# Altium project Jetson AGX Xavier Carrier Board.PrjPcb (part 1 of 8)
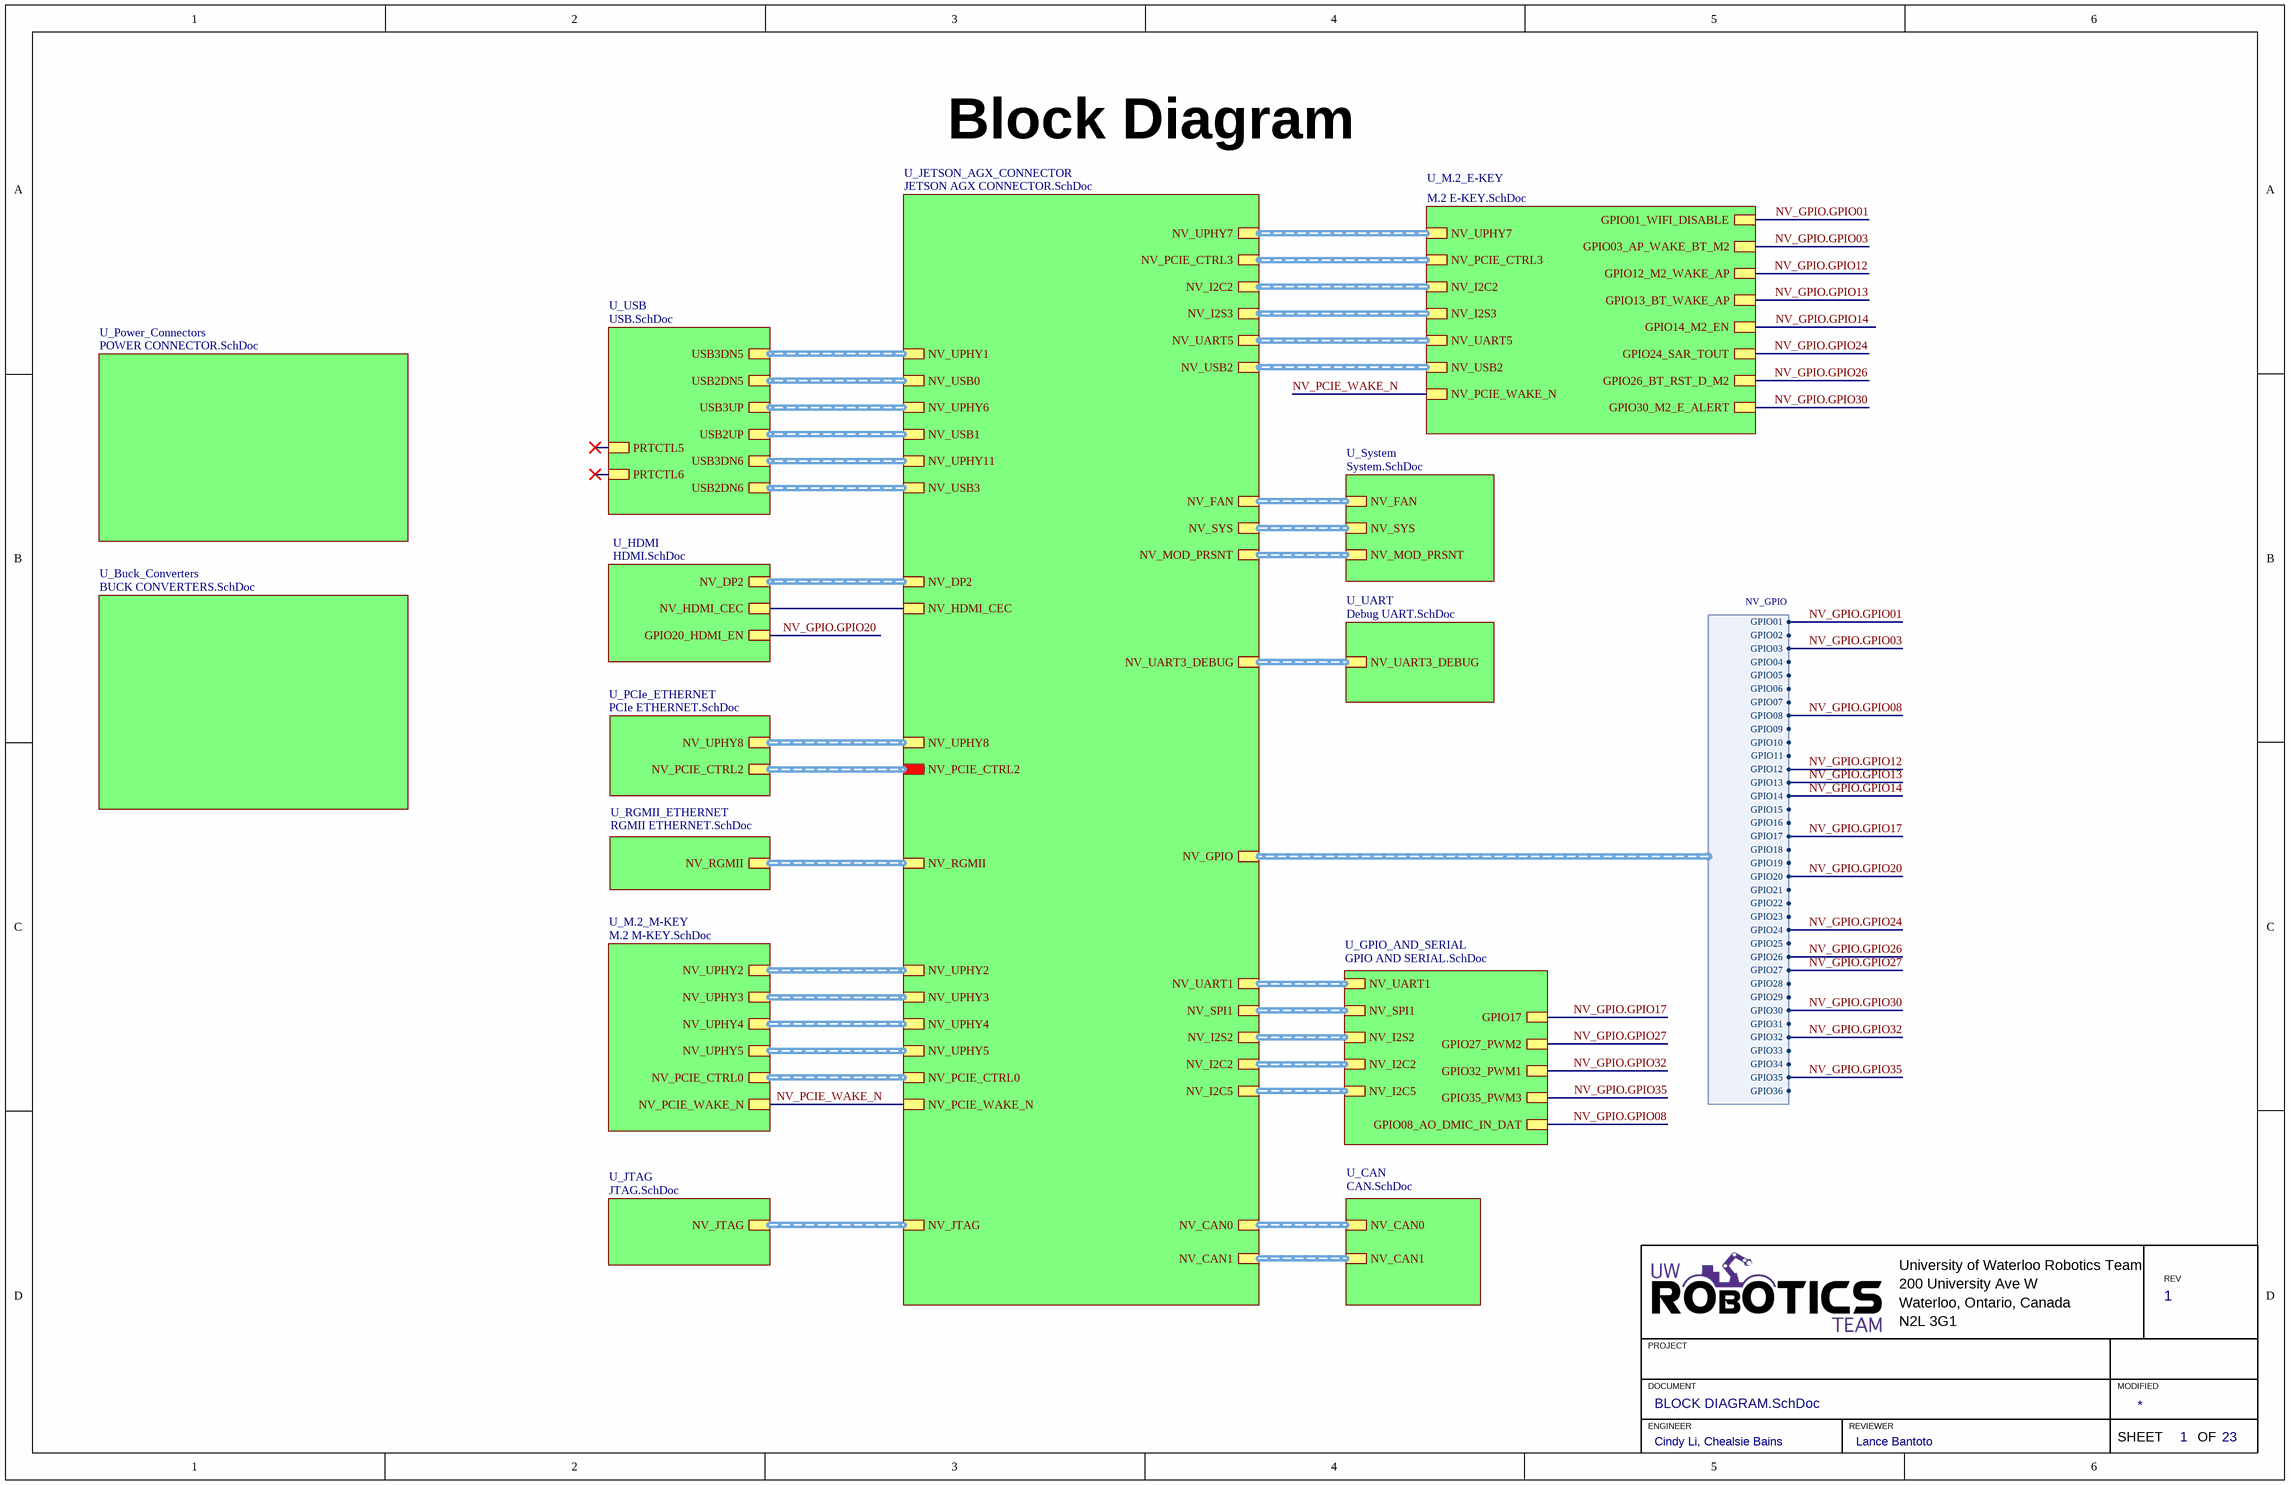
[diagram p0: BLOCK DIAGRAM.SchDoc]
23 sheets, 600 parts. Net scope: global (net labels, ports and power ports of the same name join across sheets).
Board file: Jetson AGX Xavier Carrier Board.PcbDoc
Sheets:
  BLOCK DIAGRAM.SchDoc
    U_HDMI = HDMI.SchDoc
    U_JTAG = JTAG.SchDoc
    U_USB = USB.SchDoc
      U_USB_PORT_STACKED = USB PORT STACKED.SchDoc
      U_USB_PORT_ STACKED = USB PORT STACKED.SchDoc
      U_USB_PORT_STACKED = USB PORT STACKED.SchDoc
    U_PCIe_ETHERNET = PCIe ETHERNET.SchDoc
    U_M.2_E-KEY = M.2 E-KEY.SchDoc
    U_M.2_M-KEY = M.2 M-KEY.SchDoc
    U_GPIO_AND_SERIAL = GPIO AND SERIAL.SchDoc
    U_CAN = CAN.SchDoc
    U_JETSON_AGX_CONNECTOR = JETSON AGX CONNECTOR.SchDoc
      U_JETSON_AGX_CSI-I2C-I2S = JETSON AGX CSI-I2C-I2S.SchDoc
      U_JETSON_AGX_DP-HDMI-USB-GBE = JETSON AGX DP-HDMI-USB-GBE.SchDoc
      U_JETSON_AGX_SDIO-SPI-UART-CAN-GPIO = JETSON AGX SDIO-SPI-UART-CAN-GPIO.SchDoc
      U_JETSON_AGX_SYS-PWR-GND = JETSON AGX SYS-PWR-GND.SchDoc
      U_JETSON_AGX_UPHY = JETSON AGX UPHY.SchDoc
      U_JETSON_AGX_NVHS = JETSON AGX NVHS.SchDoc
      U_JETSON_AGX_PCIE = JETSON AGX PCIE.SchDoc
    U_RGMII_ETHERNET = RGMII ETHERNET.SchDoc
    U_System = System.SchDoc
    U_UART = Debug UART.SchDoc
    U_Power_Connectors = POWER CONNECTOR.SchDoc
    U_Buck_Converters = BUCK CONVERTERS.SchDoc

## Sheet BLOCK DIAGRAM.SchDoc: Block Diagram
size 431 x 279 mm; CheckedBy: Lance Bantoto; Engineer: Cindy Li, Chealsie Bains; DocumentNumber: 1; Revision: 1; SheetNumber: 1; SheetTotal: 23

### Sub-sheets
U_Buck_Converters = BUCK CONVERTERS.SchDoc: no entries
U_CAN = CAN.SchDoc: NV_CAN0 (harness CAN), NV_CAN1 (harness CAN)
U_GPIO_AND_SERIAL = GPIO AND SERIAL.SchDoc: NV_UART1 (harness UART_5-W), NV_SPI1 (harness UART_5-W), NV_I2S2 (harness UART_5-W), GPIO17, GPIO27_PWM2, GPIO32_PWM1, GPIO35_PWM3, GPIO08_AO_DMIC_IN_DAT, NV_I2C2 (harness UART_5-W), NV_I2C5 (harness UART_5-W)
U_HDMI = HDMI.SchDoc: NV_DP2 (harness DISPLAYPORT), NV_HDMI_CEC, GPIO20_HDMI_EN
U_JETSON_AGX_CONNECTOR = JETSON AGX CONNECTOR.SchDoc: NV_UPHY7 (harness UPHY), NV_PCIE_CTRL3 (harness PCIE_CTRL), NV_I2C2 (harness I2C), NV_I2S3 (harness I2S), NV_UART5 (harness UART_5-W), NV_USB2 (harness USB2), NV_GPIO (harness NV_GPIO), NV_DP2 (harness DISPLAYPORT), NV_HDMI_CEC, NV_CAN0 (harness CAN), NV_CAN1 (harness CAN), NV_USB0 (harness USB2), NV_USB1 (harness USB2), NV_USB3 (harness USB2), NV_UPHY1 (harness UPHY), NV_UPHY6 (harness UPHY), NV_UPHY11 (harness UPHY), NV_JTAG (harness NV_JTAG), NV_UART1 (harness UART_5-W), NV_SPI1 (harness UART_5-W), NV_I2S2 (harness UART_5-W), NV_UPHY8 (harness UPHY), NV_PCIE_CTRL2 (harness PCIE_CTRL), NV_RGMII (harness RGMII), NV_UPHY2 (harness UPHY), NV_UPHY3 (harness UPHY), NV_UPHY4 (harness UPHY), NV_UPHY5 (harness UPHY), NV_PCIE_CTRL0 (harness PCIE CTRL), NV_PCIE_WAKE_N, NV_UART3_DEBUG (harness UART_5-W), NV_I2C2 (harness UART_5-W), NV_I2C5 (harness UART_5-W), NV_FAN, NV_SYS, NV_MOD_PRSNT
U_JTAG = JTAG.SchDoc: NV_JTAG (harness NV_JTAG)
U_M.2_E-KEY = M.2 E-KEY.SchDoc: NV_UPHY7 (harness UPHY), NV_PCIE_CTRL3 (harness PCIE_CTRL), NV_I2C2 (harness I2C), NV_I2S3 (harness I2S), NV_UART5 (harness UART_5-W), NV_USB2 (harness USB2), GPIO12_M2_WAKE_AP, GPIO01_WIFI_DISABLE, GPIO03_AP_WAKE_BT_M2, GPIO13_BT_WAKE_AP, GPIO14_M2_EN, GPIO24_SAR_TOUT, GPIO26_BT_RST_D_M2, GPIO30_M2_E_ALERT, NV_PCIE_WAKE_N
U_M.2_M-KEY = M.2 M-KEY.SchDoc: NV_UPHY2 (harness UPHY), NV_UPHY3 (harness UPHY), NV_UPHY4 (harness UPHY), NV_UPHY5 (harness UPHY), NV_PCIE_CTRL0 (harness PCIE CTRL), NV_PCIE_WAKE_N
U_PCIe_ETHERNET = PCIe ETHERNET.SchDoc: NV_UPHY8 (harness UPHY), NV_PCIE_CTRL2 (harness PCIE CTRL)
U_Power_Connectors = POWER CONNECTOR.SchDoc: no entries
U_RGMII_ETHERNET = RGMII ETHERNET.SchDoc: NV_RGMII (harness RGMII)
U_System = System.SchDoc: NV_FAN, NV_SYS, NV_MOD_PRSNT
U_UART = Debug UART.SchDoc: NV_UART3_DEBUG (harness UART_5-W)
U_USB = USB.SchDoc: USB2DN5 (harness USB2), USB2UP (harness USB2), USB2DN6 (harness USB2), USB3DN5 (harness UPHY), USB3UP (harness UPHY), USB3DN6 (harness UPHY), PRTCTL5, PRTCTL6

### Harnesses
NV_GPIO: GPIO01, GPIO02, GPIO03, GPIO04, GPIO05, GPIO06, GPIO07, GPIO08, GPIO09, GPIO10, GPIO11, GPIO12, GPIO13, GPIO14, GPIO15, GPIO16, GPIO17, GPIO18, GPIO19, GPIO20, GPIO21, GPIO22, GPIO23, GPIO24, GPIO25, GPIO26, GPIO27, GPIO28, GPIO29, GPIO30, GPIO31, GPIO32, GPIO33, GPIO34, GPIO35, GPIO36

### Nets
NV_GPIO.GPIO01: sheet U_M.2_E-KEY/GPIO01_WIFI_DISABLE, sheet U_JETSON_AGX_CONNECTOR/NV_GPIO.GPIO01
NV_GPIO.GPIO03: sheet U_M.2_E-KEY/GPIO03_AP_WAKE_BT_M2, sheet U_JETSON_AGX_CONNECTOR/NV_GPIO.GPIO03
NV_GPIO.GPIO08: sheet U_GPIO_AND_SERIAL/GPIO08_AO_DMIC_IN_DAT, sheet U_JETSON_AGX_CONNECTOR/NV_GPIO.GPIO08
NV_GPIO.GPIO12: sheet U_M.2_E-KEY/GPIO12_M2_WAKE_AP, sheet U_JETSON_AGX_CONNECTOR/NV_GPIO.GPIO12
NV_GPIO.GPIO13: sheet U_M.2_E-KEY/GPIO13_BT_WAKE_AP, sheet U_JETSON_AGX_CONNECTOR/NV_GPIO.GPIO13
NV_GPIO.GPIO14: sheet U_M.2_E-KEY/GPIO14_M2_EN, sheet U_JETSON_AGX_CONNECTOR/NV_GPIO.GPIO14
NV_GPIO.GPIO17: sheet U_GPIO_AND_SERIAL/GPIO17, sheet U_JETSON_AGX_CONNECTOR/NV_GPIO.GPIO17
NV_GPIO.GPIO20: sheet U_HDMI/GPIO20_HDMI_EN, sheet U_JETSON_AGX_CONNECTOR/NV_GPIO.GPIO20
NV_GPIO.GPIO24: sheet U_M.2_E-KEY/GPIO24_SAR_TOUT, sheet U_JETSON_AGX_CONNECTOR/NV_GPIO.GPIO24
NV_GPIO.GPIO26: sheet U_M.2_E-KEY/GPIO26_BT_RST_D_M2, sheet U_JETSON_AGX_CONNECTOR/NV_GPIO.GPIO26
NV_GPIO.GPIO27: sheet U_GPIO_AND_SERIAL/GPIO27_PWM2, sheet U_JETSON_AGX_CONNECTOR/NV_GPIO.GPIO27
NV_GPIO.GPIO30: sheet U_M.2_E-KEY/GPIO30_M2_E_ALERT, sheet U_JETSON_AGX_CONNECTOR/NV_GPIO.GPIO30
NV_GPIO.GPIO32: sheet U_GPIO_AND_SERIAL/GPIO32_PWM1, sheet U_JETSON_AGX_CONNECTOR/NV_GPIO.GPIO32
NV_GPIO.GPIO35: sheet U_GPIO_AND_SERIAL/GPIO35_PWM3, sheet U_JETSON_AGX_CONNECTOR/NV_GPIO.GPIO35
NV_PCIE_WAKE_N: sheet U_M.2_E-KEY/NV_PCIE_WAKE_N, sheet U_M.2_M-KEY/NV_PCIE_WAKE_N, sheet U_JETSON_AGX_CONNECTOR/NV_PCIE_WAKE_N
(unnamed): sheet U_HDMI/NV_HDMI_CEC, sheet U_JETSON_AGX_CONNECTOR/NV_HDMI_CEC

### Buses and harness runs
harness sheet U_CAN/NV_CAN0 = sheet U_JETSON_AGX_CONNECTOR/NV_CAN0
harness sheet U_CAN/NV_CAN1 = sheet U_JETSON_AGX_CONNECTOR/NV_CAN1
harness sheet U_GPIO_AND_SERIAL/NV_I2C2 = sheet U_JETSON_AGX_CONNECTOR/NV_I2C2
harness sheet U_GPIO_AND_SERIAL/NV_I2C5 = sheet U_JETSON_AGX_CONNECTOR/NV_I2C5
harness sheet U_GPIO_AND_SERIAL/NV_I2S2 = sheet U_JETSON_AGX_CONNECTOR/NV_I2S2
harness sheet U_GPIO_AND_SERIAL/NV_SPI1 = sheet U_JETSON_AGX_CONNECTOR/NV_SPI1
harness sheet U_GPIO_AND_SERIAL/NV_UART1 = sheet U_JETSON_AGX_CONNECTOR/NV_UART1
harness sheet U_HDMI/NV_DP2 = sheet U_JETSON_AGX_CONNECTOR/NV_DP2
harness sheet U_JETSON_AGX_CONNECTOR/NV_FAN = sheet U_System/NV_FAN
harness sheet U_JETSON_AGX_CONNECTOR/NV_I2C2 = sheet U_M.2_E-KEY/NV_I2C2
harness sheet U_JETSON_AGX_CONNECTOR/NV_I2S3 = sheet U_M.2_E-KEY/NV_I2S3
harness sheet U_JETSON_AGX_CONNECTOR/NV_JTAG = sheet U_JTAG/NV_JTAG
harness sheet U_JETSON_AGX_CONNECTOR/NV_MOD_PRSNT = sheet U_System/NV_MOD_PRSNT
harness sheet U_JETSON_AGX_CONNECTOR/NV_PCIE_CTRL0 = sheet U_M.2_M-KEY/NV_PCIE_CTRL0
harness sheet U_JETSON_AGX_CONNECTOR/NV_PCIE_CTRL2 = sheet U_PCIe_ETHERNET/NV_PCIE_CTRL2
harness sheet U_JETSON_AGX_CONNECTOR/NV_PCIE_CTRL3 = sheet U_M.2_E-KEY/NV_PCIE_CTRL3
harness sheet U_JETSON_AGX_CONNECTOR/NV_RGMII = sheet U_RGMII_ETHERNET/NV_RGMII
harness sheet U_JETSON_AGX_CONNECTOR/NV_SYS = sheet U_System/NV_SYS
harness sheet U_JETSON_AGX_CONNECTOR/NV_UART3_DEBUG = sheet U_UART/NV_UART3_DEBUG
harness sheet U_JETSON_AGX_CONNECTOR/NV_UART5 = sheet U_M.2_E-KEY/NV_UART5
harness sheet U_JETSON_AGX_CONNECTOR/NV_UPHY1 = sheet U_USB/USB3DN5
harness sheet U_JETSON_AGX_CONNECTOR/NV_UPHY2 = sheet U_M.2_M-KEY/NV_UPHY2
harness sheet U_JETSON_AGX_CONNECTOR/NV_UPHY3 = sheet U_M.2_M-KEY/NV_UPHY3
harness sheet U_JETSON_AGX_CONNECTOR/NV_UPHY4 = sheet U_M.2_M-KEY/NV_UPHY4
harness sheet U_JETSON_AGX_CONNECTOR/NV_UPHY5 = sheet U_M.2_M-KEY/NV_UPHY5
harness sheet U_JETSON_AGX_CONNECTOR/NV_UPHY6 = sheet U_USB/USB3UP
harness sheet U_JETSON_AGX_CONNECTOR/NV_UPHY7 = sheet U_M.2_E-KEY/NV_UPHY7
harness sheet U_JETSON_AGX_CONNECTOR/NV_UPHY8 = sheet U_PCIe_ETHERNET/NV_UPHY8
harness sheet U_JETSON_AGX_CONNECTOR/NV_UPHY11 = sheet U_USB/USB3DN6
harness sheet U_JETSON_AGX_CONNECTOR/NV_USB0 = sheet U_USB/USB2DN5
harness sheet U_JETSON_AGX_CONNECTOR/NV_USB1 = sheet U_USB/USB2UP
harness sheet U_JETSON_AGX_CONNECTOR/NV_USB2 = sheet U_M.2_E-KEY/NV_USB2
harness sheet U_JETSON_AGX_CONNECTOR/NV_USB3 = sheet U_USB/USB2DN6

### Notes on the sheet
- University of Waterloo Robotics Team
- 200 University Ave W
- REV
- PROJECT
- Waterloo, Ontario, Canada
- N2L 3G1
- DOCUMENT
- ENGINEER
- REVIEWER
- MODIFIED
- SHEET
- OF

## Sheet HDMI.SchDoc: HDMI
size 431 x 279 mm; CheckedBy: Lance Bantoto; Engineer: Cindy Li; DocumentNumber: 15; Revision: 1; SheetNumber: 15; SheetTotal: 23
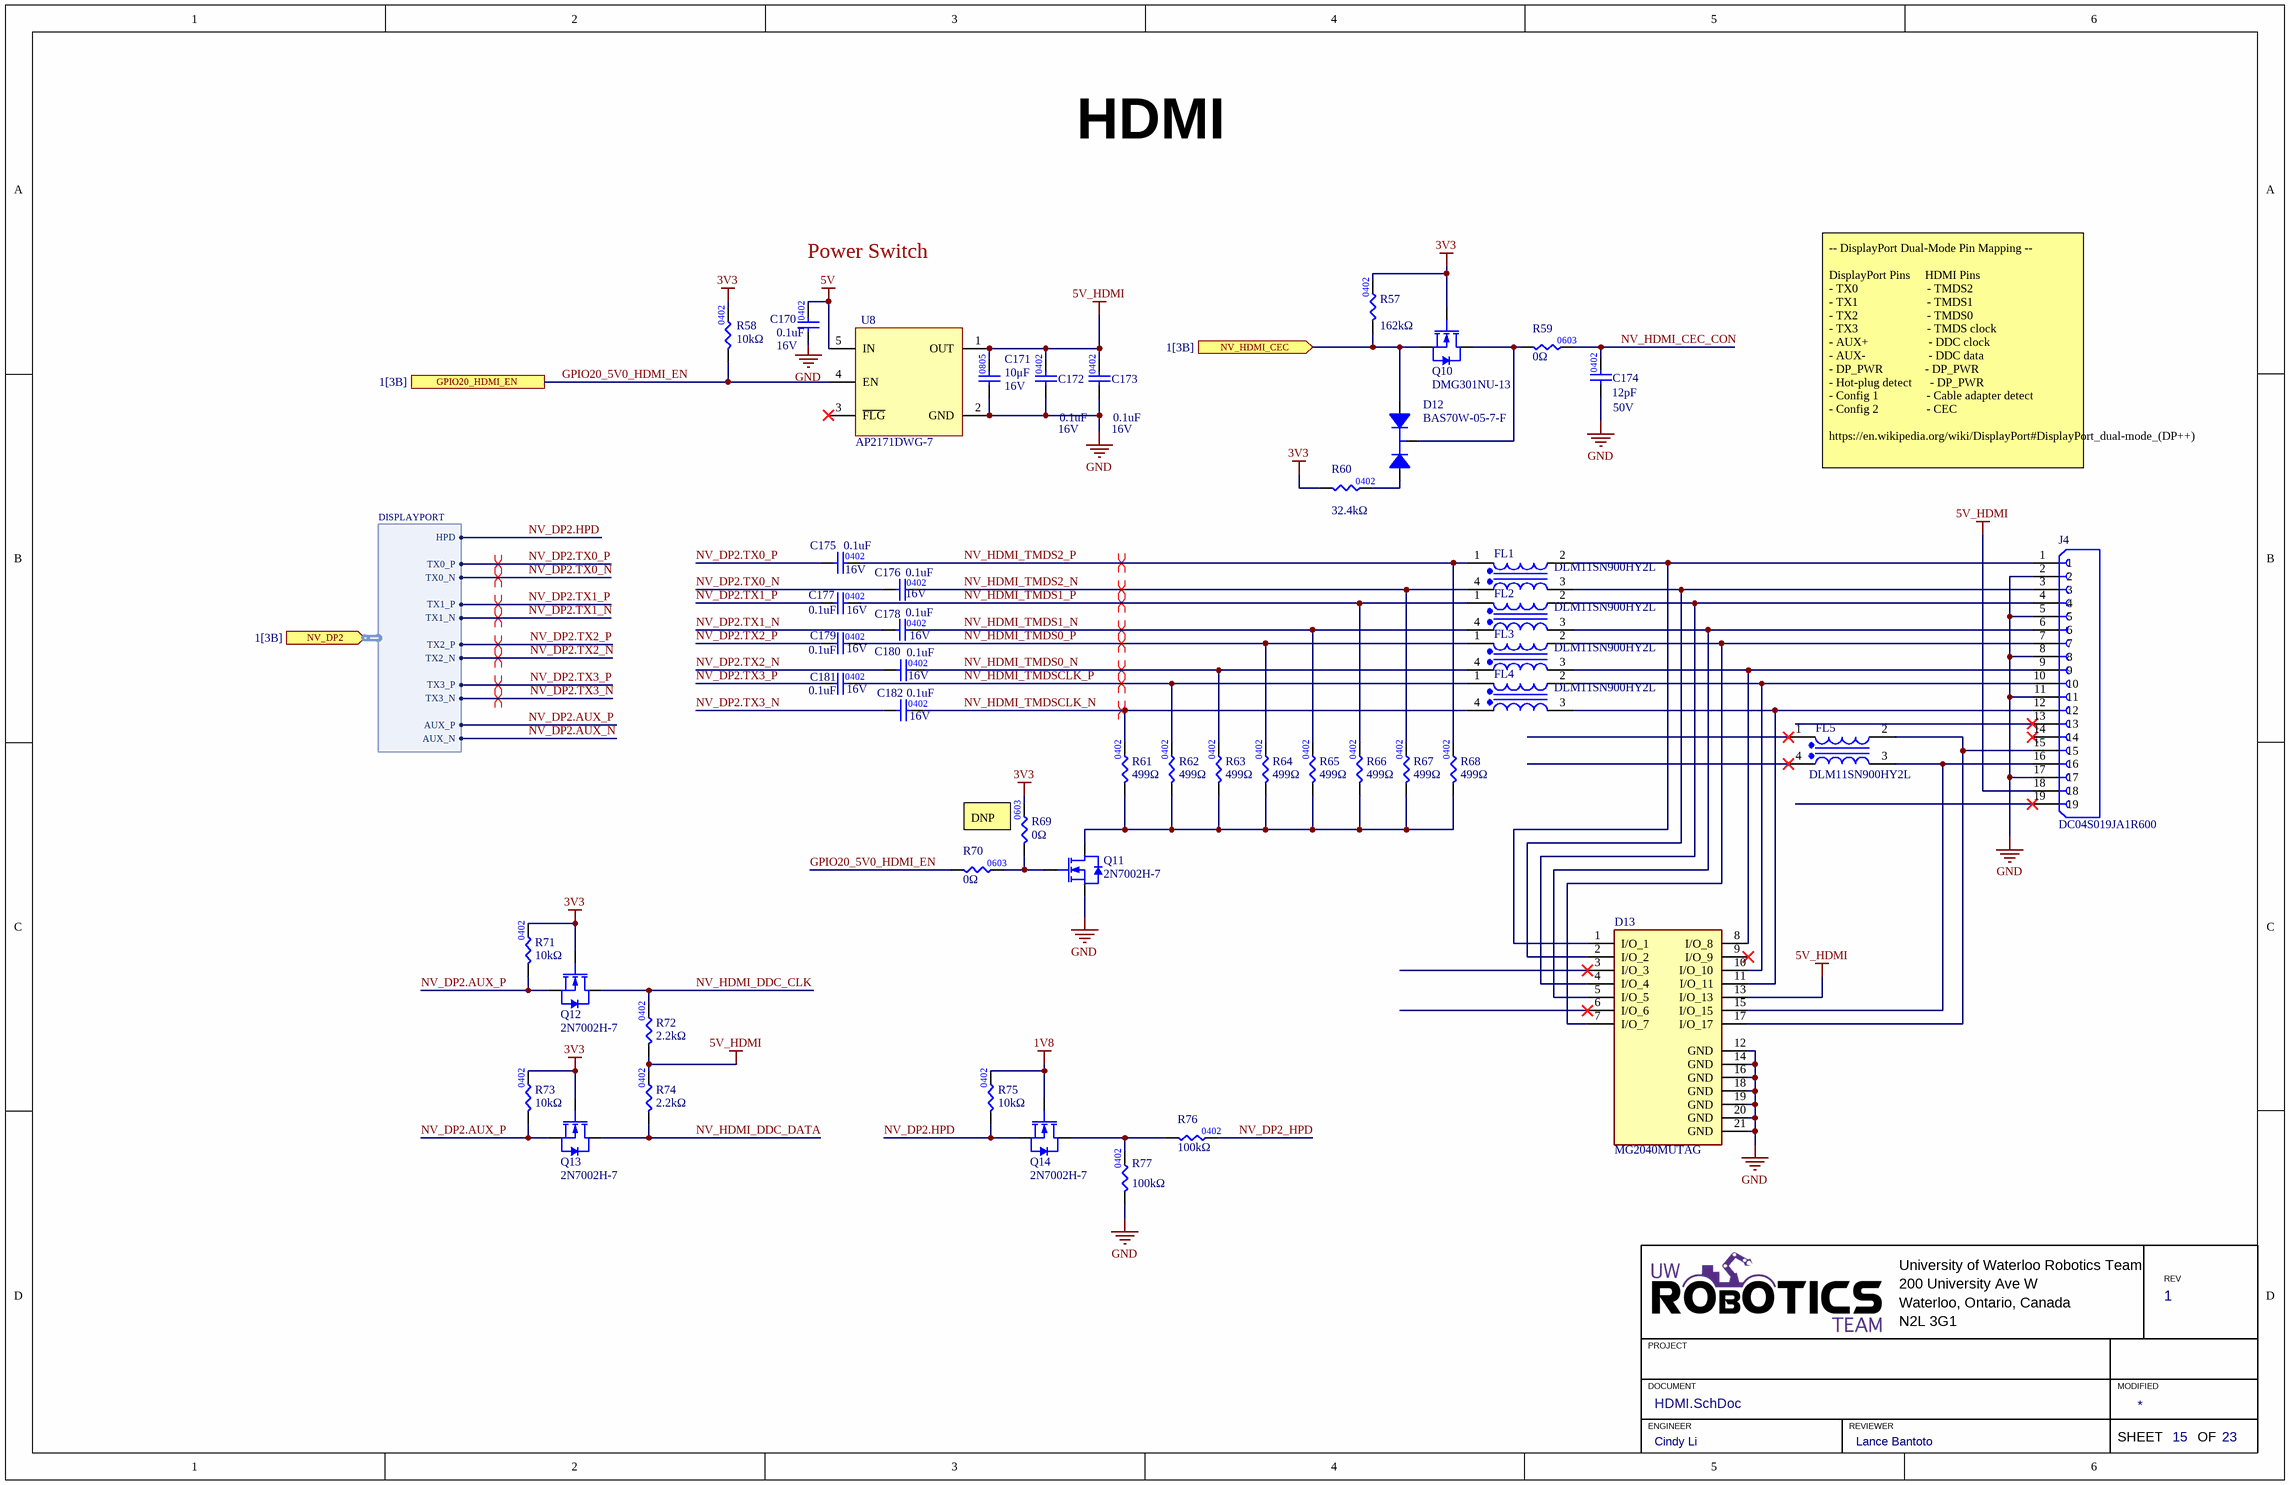
[diagram p1: HDMI.SchDoc]

### Parts
C170  Rated DC Voltage (URdc): 16V  Capacitance: 0.1uF  [CAP0402]  (hidden comment: CAP_0.1uF_16V_X7R_0402)
C171  value 10μF  Voltage Rating: 16V  [CAP2012]  (hidden comment: CAP_10uF_16V_0805)
C172  Rated DC Voltage (URdc): 16V  Capacitance: 0.1uF  [CAP0402]  (hidden comment: CAP_0.1uF_16V_X7R_0402)
C173  Rated DC Voltage (URdc): 16V  Capacitance: 0.1uF  [CAP0402]  (hidden comment: CAP_0.1uF_16V_X7R_0402)
C174  value 12pF  Voltage Rating: 50V  [CAP0402]  (hidden comment: CAP_12pF_50V_0402)
C175  Capacitance: 0.1uF  Rated DC Voltage (URdc): 16V  [CAP0402]  (hidden comment: CAP_0.1uF_16V_X7R_0402)
C176  Capacitance: 0.1uF  Rated DC Voltage (URdc): 16V  [CAP0402]  (hidden comment: CAP_0.1uF_16V_X7R_0402)
C177  Capacitance: 0.1uF  Rated DC Voltage (URdc): 16V  [CAP0402]  (hidden comment: CAP_0.1uF_16V_X7R_0402)
C178  Capacitance: 0.1uF  Rated DC Voltage (URdc): 16V  [CAP0402]  (hidden comment: CAP_0.1uF_16V_X7R_0402)
C179  Capacitance: 0.1uF  Rated DC Voltage (URdc): 16V  [CAP0402]  (hidden comment: CAP_0.1uF_16V_X7R_0402)
C180  Capacitance: 0.1uF  Rated DC Voltage (URdc): 16V  [CAP0402]  (hidden comment: CAP_0.1uF_16V_X7R_0402)
C181  Capacitance: 0.1uF  Rated DC Voltage (URdc): 16V  [CAP0402]  (hidden comment: CAP_0.1uF_16V_X7R_0402)
C182  Capacitance: 0.1uF  Rated DC Voltage (URdc): 16V  [CAP0402]  (hidden comment: CAP_0.1uF_16V_X7R_0402)
D12  BAS70W-05-7-F  [SOT323_BAS70W-05-7-F]
D13  MG2040MUTAG  [DIO_MG2040MUTAG]
FL1  DLM11SN900HY2L  [FIL_DLM11SN900HY2L]
FL2  DLM11SN900HY2L  [FIL_DLM11SN900HY2L]
FL3  DLM11SN900HY2L  [FIL_DLM11SN900HY2L]
FL4  DLM11SN900HY2L  [FIL_DLM11SN900HY2L]
FL5  DLM11SN900HY2L  [FIL_DLM11SN900HY2L]
J4  DC04S019JA1R600  [JAE_DC04S019JA1R600]
Q10  DMG301NU-13  [SOT23-3]
Q11  2N7002H-7  [SOT23-3]
Q12  2N7002H-7  [SOT23-3]
Q13  2N7002H-7  [SOT23-3]
Q14  2N7002H-7  [SOT23-3]
R57  value 162kΩ  [RES0402]  (hidden comment: RES_162kΩ_0402_1%)
R58  value 10kΩ  [RES0402]  (hidden comment: RES_10kΩ_0402_1%)
R59  value 0Ω  [RES0603]  (hidden comment: RES_0Ω_0603)
R60  value 32.4kΩ  [RES0402]  (hidden comment: RES_32.4kΩ_0402_1%)
R61  value 499Ω  [RES0402]  (hidden comment: RES_499Ω_0402_1%)
R62  value 499Ω  [RES0402]  (hidden comment: RES_499Ω_0402_1%)
R63  value 499Ω  [RES0402]  (hidden comment: RES_499Ω_0402_1%)
R64  value 499Ω  [RES0402]  (hidden comment: RES_499Ω_0402_1%)
R65  value 499Ω  [RES0402]  (hidden comment: RES_499Ω_0402_1%)
R66  value 499Ω  [RES0402]  (hidden comment: RES_499Ω_0402_1%)
R67  value 499Ω  [RES0402]  (hidden comment: RES_499Ω_0402_1%)
R68  value 499Ω  [RES0402]  (hidden comment: RES_499Ω_0402_1%)
R69  value 0Ω  [RES0603]  (hidden comment: RES_0Ω_0603)
R70  value 0Ω  [RES0603]  (hidden comment: RES_0Ω_0603)
R71  value 10kΩ  [RES0402]  (hidden comment: RES_10kΩ_0402_1%)
R72  value 2.2kΩ  [RES0402]  (hidden comment: RES_2.2kΩ_0402_5%)
R73  value 10kΩ  [RES0402]  (hidden comment: RES_10kΩ_0402_1%)
R74  value 2.2kΩ  [RES0402]  (hidden comment: RES_2.2kΩ_0402_5%)
R75  value 10kΩ  [RES0402]  (hidden comment: RES_10kΩ_0402_1%)
R76  value 100kΩ  [RES0402]  (hidden comment: RES_100kΩ_0402_5%)
R77  value 100kΩ  [RES0402]  (hidden comment: RES_100kΩ_0402_5%)
U8  AP2171DWG-7  [AP2171DWG-7]

### Ports
GPIO20_HDMI_EN (see 1[3B]), NV_DP2 (in, harness DISPLAYPORT, see 1[3B]), NV_HDMI_CEC (in, see 1[3B])

### Harnesses
DISPLAYPORT: HPD, TX0_P, TX0_N, TX1_P, TX1_N, TX2_P, TX2_N, TX3_P, TX3_N, AUX_P, AUX_N

### Nets
1V8: Q14.1(GATE) R75.2
3V3: Q10.1(GATE) Q12.1(GATE) Q13.1(GATE) R57.2 R58.2 R60.1 R69.2 R71.2 R73.2
5V: C170.2 U8.5(IN)
5V_HDMI: C171.2 C172.2 C173.2 D13.13(I/O_13) J4.18 R72.1 R74.2 U8.1(OUT)
GND: C170.1 C171.1 C172.1 C173.1 C174.1 D13.12(GND) D13.14(GND) D13.16(GND) D13.18(GND) D13.19(GND) D13.20(GND) D13.21(GND) J4.2 J4.5 J4.8 J4.11 J4.17 Q11.2(SOURCE) R77.1 U8.2(GND)
GPIO20_5V0_HDMI_EN: R58.1 R70.1 U8.4(EN) ; port GPIO20_HDMI_EN
NV_DP2.AUX_P: Q12.2(SOURCE) Q13.2(SOURCE) R71.1 R73.1 ; port NV_DP2.AUX_P
NV_DP2.HPD: Q14.2(SOURCE) R75.1 ; port NV_DP2.HPD
NV_DP2.TX0_N: C176.1 ; port NV_DP2.TX0_N
NV_DP2.TX0_P: C175.1 ; port NV_DP2.TX0_P
NV_DP2.TX1_N: C178.1 ; port NV_DP2.TX1_N
NV_DP2.TX1_P: C177.1 ; port NV_DP2.TX1_P
NV_DP2.TX2_N: C180.1 ; port NV_DP2.TX2_N
NV_DP2.TX2_P: C179.1 ; port NV_DP2.TX2_P
NV_DP2.TX3_N: C182.1 ; port NV_DP2.TX3_N
NV_DP2.TX3_P: C181.1 ; port NV_DP2.TX3_P
NV_DP2_HPD: R76.2
NV_HDMI_CEC: D12.2 Q10.2(SOURCE) R57.1 ; port NV_HDMI_CEC
NV_HDMI_CEC_CON: C174.2 R59.2
NV_HDMI_DDC_CLK: Q12.3(DRAIN) R72.2
NV_HDMI_DDC_DATA: Q13.3(DRAIN) R74.1
NV_HDMI_TMDS0_N: C180.2 FL3.4 R63.2
NV_HDMI_TMDS0_P: C179.2 FL3.1 R64.2
NV_HDMI_TMDS1_N: C178.2 FL2.4 R65.2
NV_HDMI_TMDS1_P: C177.2 FL2.1 R66.2
NV_HDMI_TMDS2_N: C176.2 FL1.4 R67.2
NV_HDMI_TMDS2_P: C175.2 FL1.1 R68.2
NV_HDMI_TMDSCLK_N: C182.2 FL4.4 R61.2
NV_HDMI_TMDSCLK_P: C181.2 FL4.1 R62.2
NetD12_1: D12.1 R60.2
NetD12_3: D12.3 Q10.3(DRAIN) R59.1
NetD13_1: D13.1(I/O_1) FL1.2 J4.1
NetD13_2: D13.2(I/O_2) FL1.3 J4.3
NetD13_4: D13.4(I/O_4) FL2.2 J4.4
NetD13_5: D13.5(I/O_5) FL2.3 J4.6
NetD13_7: D13.7(I/O_7) FL3.2 J4.7
NetD13_8: D13.8(I/O_8) FL3.3 J4.9
NetD13_10: D13.10(I/O_10) FL4.2 J4.10
NetD13_11: D13.11(I/O_11) FL4.3 J4.12
NetD13_15: D13.15(I/O_15) FL5.3 J4.16
NetD13_17: D13.17(I/O_17) FL5.2 J4.15
NetQ11_1: Q11.1(GATE) R69.1 R70.2
NetQ11_3: Q11.3(DRAIN) R61.1 R62.1 R63.1 R64.1 R65.1 R66.1 R67.1 R68.1
NetQ14_3: Q14.3(DRAIN) R76.1 R77.2

Not connected (* = marked no-connect by the designer): D13 3(I/O_3)* 6(I/O_6)* 9(I/O_9)*; FL5 1* 4*; J4 13* 14* 19*; U8 3(~{FLG})*

### Layout directives
differential pair: NV_DP2.TX0_N, NV_DP2.TX0_P, NV_DP2.TX1_N, NV_DP2.TX1_P, NV_DP2.TX2_N, NV_DP2.TX2_P, NV_DP2.TX3_N, NV_DP2.TX3_P, NV_HDMI_TMDS0_N, NV_HDMI_TMDS0_P, NV_HDMI_TMDS1_N, NV_HDMI_TMDS1_P, NV_HDMI_TMDS2_N, NV_HDMI_TMDS2_P, NV_HDMI_TMDSCLK_N, NV_HDMI_TMDSCLK_P

### Notes on the sheet
- Power Switch
- -- DisplayPort Dual-Mode Pin Mapping --
  DisplayPort Pins     HDMI Pins
  - TX0                       - TMDS2
  - TX1                       - TMDS1
  - TX2                       - TMDS0
  - TX3                       - TMDS clock
  - AUX+                    - DDC clock
  - AUX-                     - DDC data
  - DP_PWR              - DP_PWR
  - Hot-plug detect      - DP_PWR
  - Config 1                - Cable adapter detect
  - Config 2                - CEC
  https://en.wikipedia.org/wiki/DisplayPort#DisplayPort_dual-mode_(DP++)
- (near R69) DNP
- University of Waterloo Robotics Team
- 200 University Ave W
- REV
- PROJECT
- Waterloo, Ontario, Canada
- N2L 3G1
- DOCUMENT
- ENGINEER
- REVIEWER
- MODIFIED
- SHEET
- OF

### Library data of the parts
C170 C172 C173 C175-C182 = CAP_0.1uF_16V_X7R_0402: Ceramic Capacitor, Ceramic; Manufacturer: Taiyo Yuden; Manufacturer Part Number: LMK212AC6106MD-T; Multilayer: Yes; Negative Tolerance: 10%; Temperature Characteristics Code: X7R; Supplier Part Number 1: 587-6337-1-ND; Supplier 1: Digi-Key; RoHS: Yes; Stock 1: 703; Pricing 1: 1=0.29000, 10=0.20100, 50=0.12060, 100=0.10180, 500=0.06966, 1000=0.06163 (USD); ComponentLink1URL: https://datasheet.ciiva.com:443/pdfs/VipMasterIC/IC/TAIY/TAIY-S-A0009099504/TAIY-S-A0009099407-1.pdf?src-supplier=IHS+Markit; ComponentLink1Description: https://datasheet.ciiva.com:443/pdfs/VipMasterIC/IC/TAIY/TAIY-S-A0009099504/TAIY-S-A0009099407-1.pdf?src-supplier=IHS+Markit; ComponentLink2URL: https://ds.yuden.co.jp/TYCOMPAS/ut/detail?pn=LMK212AC6106MD-T &amp;u=M&src-supplier=Digi-Key; ComponentLink2Description: https://ds.yuden.co.jp/TYCOMPAS/ut/detail?pn=LMK212AC6106MD-T &amp;u=M&src-supplier=Digi-Key; Supplier 2: Digi-Key; Supplier Part Number 2: 1292-1630-1-ND; Category: Ceramic Capacitors; Stock 2: 20327886; Pricing 2: 1=0.10000, 10=0.02800, 50=0.01500, 100=0.01220, 500=0.00876, 1000=0.00688, 2500=0.00625, 5000=0.00575 (USD); Mount: Surface Mount; Number of Pins: 2; Dielectric Material: Ceramic; Package Shape: Rectangular; Terminal Finish: Nickel; Min Operating Temperature: -55°C; Max Operating Temperature: 125°C; JESD-609 Code: e3; Capacitor Type: Ceramic; Package Style: SMTMeter; Packaging: Tape and Reel; Positive Tolerance: 10%; Termination: Wraparound; Length: 1mm; Width: 0.5mm; Height: 0.5mm; REACH SVHC: Yes; RoHS Compliant: Yes; ComponentLink3URL: https://datasheet.ciiva.com:443/pdfs/VipMasterIC/IC/WATC/WATC-S-A0009550342/WATC-S-A0009550342-1.pdf?src-supplier=IHS+Markit; ComponentLink3Description: https://datasheet.ciiva.com:443/pdfs/VipMasterIC/IC/WATC/WATC-S-A0009550342/WATC-S-A0009550342-1.pdf?src-supplier=IHS+Markit; ComponentLink4URL: http://www.farnell.com/datasheets/2340522.pdf?src-supplier=Farnell; ComponentLink4Description: http://www.farnell.com/datasheets/2340522.pdf?src-supplier=Farnell; ComponentLink5URL: http://components.arrow.com/part/dataview/0323_00654690?src-supplier=Arrow+Europe; ComponentLink5Description: http://components.arrow.com/part/dataview/0323_00654690?src-supplier=Arrow+Europe; ComponentLink6URL: https://www.verical.com/server-webapp/html/getDatasheet?partID=415228&src-supplier=Verical; ComponentLink6Description: https://www.verical.com/server-webapp/html/getDatasheet?partID=415228&src-supplier=Verical; ComponentLink7URL: http://www.passivecomponent.com/indexsea/0402B104K160CT-IN.pdf?src-supplier=Digi-Key; ComponentLink7Description: http://www.passivecomponent.com/indexsea/0402B104K160CT-IN.pdf?src-supplier=Digi-Key; ComponentLink8URL: http://www.passivecomponent.com/wp-content/uploads/2018/10/MLCC.pdf?src-supplier=Digi-Key; ComponentLink8Description: http://www.passivecomponent.com/wp-content/uploads/2018/10/MLCC.pdf?src-supplier=Digi-Key; ComponentLink9URL: http://www.farnell.com/datasheets/2340522.pdf?src-supplier=Element14; ComponentLink9Description: http://www.farnell.com/datasheets/2340522.pdf?src-supplier=Element14; ComponentLink10URL: http://www.farnell.com/datasheets/2340522.pdf?src-supplier=Newark; ComponentLink10Description: http://www.farnell.com/datasheets/2340522.pdf?src-supplier=Newark; Size Code: 0402; Supplier 3: Digi-Key; Supplier Part Number 3: 445-173645-1-ND; Stock 3: 3627; Pricing 3: 1=0.20000, 10=0.14200, 50=0.08080, 100=0.06700, 500=0.04696, 1000=0.03888, 2500=0.03619, 5000=0.03311 (USD); ComponentLink11URL: https://datasheet.ciiva.com:443/pdfs/VipMasterIC/IC/TDKC/TDKC-S-A0007785269/TDKC-S-A0007785269-1.pdf?src-supplier=IHS+Markit; ComponentLink11Description: https://datasheet.ciiva.com:443/pdfs/VipMasterIC/IC/TDKC/TDKC-S-A0007785269/TDKC-S-A0007785269-1.pdf?src-supplier=IHS+Markit; ComponentLink12URL: https://product.tdk.com/info/en/catalog/spec/mlccspec_commercial_soft_en.pdf?src-supplier=Digi-Key; ComponentLink12Description: https://product.tdk.com/info/en/catalog/spec/mlccspec_commercial_soft_en.pdf?src-supplier=Digi-Key
C171 = CAP_10uF_16V_0805: CAP CER 10UF 16V X5R 0805; Manufacturer 1: Yageo; Manufacturer Part Number 1: CC0805KKX5R7BB106; Package/Footprint: 0805; Supplier Part Number 1: 311-1865-1-ND; Supplier 1: Digi-Key; Mounting Type: SMD; Dielectric: X5R
C174 = CAP_12pF_50V_0402: CAP CER 12PF 50V C0G 0402; Manufacturer Part Number 1: CC0603KRX7R9BB104; Manufacturer 1: TDK Corporation; Package/Footprint: 0402; Dielectric: C0G, NP0; Tolerance: ±5%; Supplier Part Number 1: 445-5585-1-ND; Supplier 1: Digi-Key; Mounting Type: SMD
D12 = BAS70W-05-7-F: DIODE ARRAY SCHOTTKY 70V SOT323; Manufacturer 1: Diodes Incorporated; Diode Configuration: 1 Pair Common Cathode; Current - Average Rectified (Io) (per diode): 70mA; Voltage - Forward (Vf) (Max) @ If: 1V @ 15mA; Current - Reverse Leakage @ Vr: 100nA @ 50V; Manufacturer Part Number 1: BAS70W-05-7-F; Supplier 1: Digi-Key; Supplier Part Number 1: BAS70W-05FDICT-ND; Diode Type: Schottky; Package: SOT-323; Voltage - DC Reverse (Vr) (Max): 70V
D13 = MG2040MUTAG: 10V Clamp 1A (8/20µs) Ipp Tvs Diode Surface Mount 18-UDFN (5.5x1.5); Manufacturer 1: ON Semiconductor; Manufacturer Part Number 1: MG2040MUTAG; Supplier 1: Digi-Key; Supplier Part Number 1: MG2040MUTAGCT-ND; Package: 18-UFDFN
FL1-FL5 = DLM11SN900HY2L: 2 Line Common Mode Choke Surface Mount 90 Ohms @ 100 MHz 100mA DCR 1.38Ohm; Manufacturer 1: Murata Electronics; Voltage Rating - DC: 5V; Manfuacturer Part Number 1: DLM11SN900HY2L; Supplier 1: Digi-Key; Supplier Part Number 1: 490-11941-1-ND; Current Rating (Max): 100mA; DC Resistance (DCR) (Max): 1.38Ohm; Package: 0504
J4 = DC04S019JA1R600: HDMI HDMI 2.1 Receptacle Connector 19 Position Surface Mount, Right Angle; Through Hole; Manufacturer 1: JAE Electronics; Current Rating: 0.5A; Manufacturer Part Number 1: DC04S019JA1R600; Supplier 1: Digi-Key; Supplier Part Number 1: 670-3154-1-ND; Specifications: HDMI 2.1; Mounting Type: Surface Mount, Right Angle; Through Hole
Q10 = DMG301NU-13: MOSFET N-CH 25V 260MA SOT23; Manufacturer 1: Diodes Incorporated; Package/Footprint: SOT-23; Id: 260mA (Ta); Vgs (Max): ±8V; Supplier 1: Digi-Key; Mounting Type: SMD; Supplier Part Number 1: DMG301NU-13DICT-ND; Vdss: 25V; Verified: No; Manufacturer Part Number 1: DMG301NU-13
Q11-Q14 = 2N7002H-7: MOSFET N-CH 60V 170MA SOT23; Manufacturer 1: Diodes Incorporated; Package/Footprint: SOT-23; Vgs (Max): ±20V; Supplier 1: Digi-Key; Mounting Type: SMD; Supplier Part Number 1: 2N7002H-7DICT-ND; Id: 170mA; Vdss: 60V; Verified: No; Manufacturer Part Number 1: 2N7002H-7
R57 = RES_162kΩ_0402_1%: RES 162K OHM 1% 1/16W 0402; Manufacturer Part Number 1: RMCF0402FT162K; Manufacturer 1: Panasonic Electronic Components; Power: 0.063W, 1/16W; Package/Footprint: 0402; Supplier 1: Digi-Key; Supplier Part Number 1: RMCF0402FT162KCT-ND; Mounting Type: SMD; Tolerance: 1%
R58 R71 R73 R75 = RES_10kΩ_0402_1%: RES SMD 10K OHM 1% 1/16W 0402; Manufacturer Part Number 1: CRCW040210K0FKTD; Manufacturer 1: Vishay Dale; Power: 0.063W, 1/16W; Package/Footprint: 0402; Supplier 1: Digi-Key; Supplier Part Number 1: 541-2955-1-ND; Mounting Type: SMD; Tolerance: 1%
R59 R69 R70 = RES_0Ω_0603: RES 0 OHM JUMPER 1/10W 0603; Manufacturer 1: Yageo; Manufacturer Part Number 1: RC0603JR-070RL; Package/Footprint: 0603; Supplier Part Number 1: 311-0.0GRCT-ND; Supplier 1: Digi-Key; Mounting Type: SMD
R60 = RES_32.4kΩ_0402_1%: RES SMD 32.4K OHM 1% 1/10W 0402; Manufacturer Part Number 1: ERJ-2RKF3242X; Manufacturer 1: Panasonic Electronic Components; Power: 0.1W, 1/10W; Package/Footprint: 0402; Supplier 1: Digi-Key; Supplier Part Number 1: P32.4KLCT-ND; Mounting Type: SMD; Tolerance: 1%
R61-R68 = RES_499Ω_0402_1%: RES 499 OHM 1% 1/16W 0402; Manufacturer Part Number 1: RMCF0402FT499R; Manufacturer 1: Stackpole Electronics Inc; Package/Footprint: 0402; Power: 0.063W, 1/16W; Supplier 1: Digi-Key; Supplier Part Number 1: RMCF0402FT499RCT-ND; Mounting Type: SMD; Tolerance: 1%
R72 R74 = RES_2.2kΩ_0402_5%: RES SMD 2.2K OHM 5% 1/10W 0402; Manufacturer 1: Panasonic Electronic Components; Manufacturer Part Number 1: ERJ-2GEJ222X; Package/Footprint: 0402; Supplier Part Number 1: P2.2KJCT-ND; Supplier 1: Digi-Key; Mounting Type: SMD
R76 R77 = RES_100kΩ_0402_5%: RES SMD 100K OHM 5% 1/10W 0402; Manufacturer Part Number 1: ERJ-2GEJ104X; Manufacturer 1: Panasonic Electronic Components; Power: 0.1W, 1/10W; Package/Footprint: 0402; Supplier 1: Digi-Key; Supplier Part Number 1: P100KJCT-ND; Mounting Type: SMD; Tolerance: 5%
U8 = AP2171DWG-7: Power Switch/Driver 1:1 P-Channel 1A SOT-25; Manufacturer 1: Diodes Incorporated; Rds On (Typ): 95mOhm; Voltage - Load: 2.7V - 5.5V; Supplier 1: Digi-Key; Supplier Part Number 1: AP2171DWG-7DICT-ND; Manufacturer Part Number 1: AP2171DWG-7; Current - Output (Max): 1A; Package: SOT-25

## Sheet JTAG.SchDoc: JTAG
size 279 x 215 mm; CheckedBy: Lance Bantoto; Engineer: Cindy Li; DocumentNumber: 23; Revision: 1; SheetNumber: 23; SheetTotal: 23
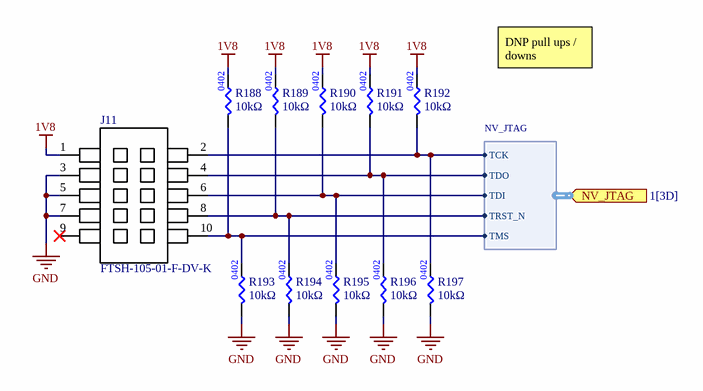
[diagram p2: JTAG.SchDoc]

### Parts
J11  Manufacturer Part Number 1: FTSH-105-01-F-DV-K  [FTSH-105-01-F-DV-K-P-TR]  (hidden comment: CON_PROGRAMMING)
R188  Resistance: 10kΩ  [RES0402]  (hidden comment: RES_10kΩ_0402_1%)
R189  Resistance: 10kΩ  [RES0402]  (hidden comment: RES_10kΩ_0402_1%)
R190  Resistance: 10kΩ  [RES0402]  (hidden comment: RES_10kΩ_0402_1%)
R191  Resistance: 10kΩ  [RES0402]  (hidden comment: RES_10kΩ_0402_1%)
R192  Resistance: 10kΩ  [RES0402]  (hidden comment: RES_10kΩ_0402_1%)
R193  Resistance: 10kΩ  [RES0402]  (hidden comment: RES_10kΩ_0402_1%)
R194  Resistance: 10kΩ  [RES0402]  (hidden comment: RES_10kΩ_0402_1%)
R195  Resistance: 10kΩ  [RES0402]  (hidden comment: RES_10kΩ_0402_1%)
R196  Resistance: 10kΩ  [RES0402]  (hidden comment: RES_10kΩ_0402_1%)
R197  Resistance: 10kΩ  [RES0402]  (hidden comment: RES_10kΩ_0402_1%)

### Ports
NV_JTAG (in, harness NV_JTAG, see 1[3D])

### Harnesses
NV_JTAG: TCK, TDI, TDO, TMS, TRST_N

### Nets
1V8: J11.1 R188.2 R189.2 R190.2 R191.2 R192.2
GND: J11.3 J11.5 J11.7 R193.1 R194.1 R195.1 R196.1 R197.1
NV_JTAG.TCK: J11.2 R192.1 R197.2 ; port NV_JTAG.TCK
NV_JTAG.TDI: J11.6 R190.1 R195.2 ; port NV_JTAG.TDI
NV_JTAG.TDO: J11.4 R191.1 R196.2 ; port NV_JTAG.TDO
NV_JTAG.TMS: J11.10 R188.1 R193.2 ; port NV_JTAG.TMS
NV_JTAG.TRST_N: J11.8 R189.1 R194.2 ; port NV_JTAG.TRST_N

Not connected (* = marked no-connect by the designer): J11 9*

### Notes on the sheet
- DNP pull ups / downs
- University of Waterloo Robotics Team
- 200 University Ave W
- REV
- PROJECT
- Waterloo, Ontario, Canada
- N2L 3G1
- DOCUMENT
- ENGINEER
- REVIEWER
- MODIFIED
- SHEET
- OF

### Library data of the parts
J11 = CON_PROGRAMMING: CONN HEADER SMD 10POS 1.27MM; Manufacturer 1: Samtec; Supplier 1: Digi-Key; Pitch: 1.27mm; Supplier Part Number 1: SAM8796-ND; Mounting Type: SMD
R188-R197 = RES_10kΩ_0402_1%: RES 10K OHM 1% 1/16W 0402; Manufacturer 1: Samsung Electro-Mechanics; Manufacturer Part Number 1: RC1005F103CS; Supplier Part Number 1: 1276-3431-1-ND; Supplier 1: Digi-Key; Tolerance: 1%; Package: 0402

## Sheet USB.SchDoc: USB
size 431 x 279 mm; CheckedBy: Lance Bantoto; Engineer: Cindy Li; Organization: UW Robotics; Address1: 200 University Avenue; Address2: Waterloo; Address3: Ontario; Address4: Canada N2L 3G6; DocumentNumber: 13; Revision: 1; SheetNumber: 13; SheetTotal: 23
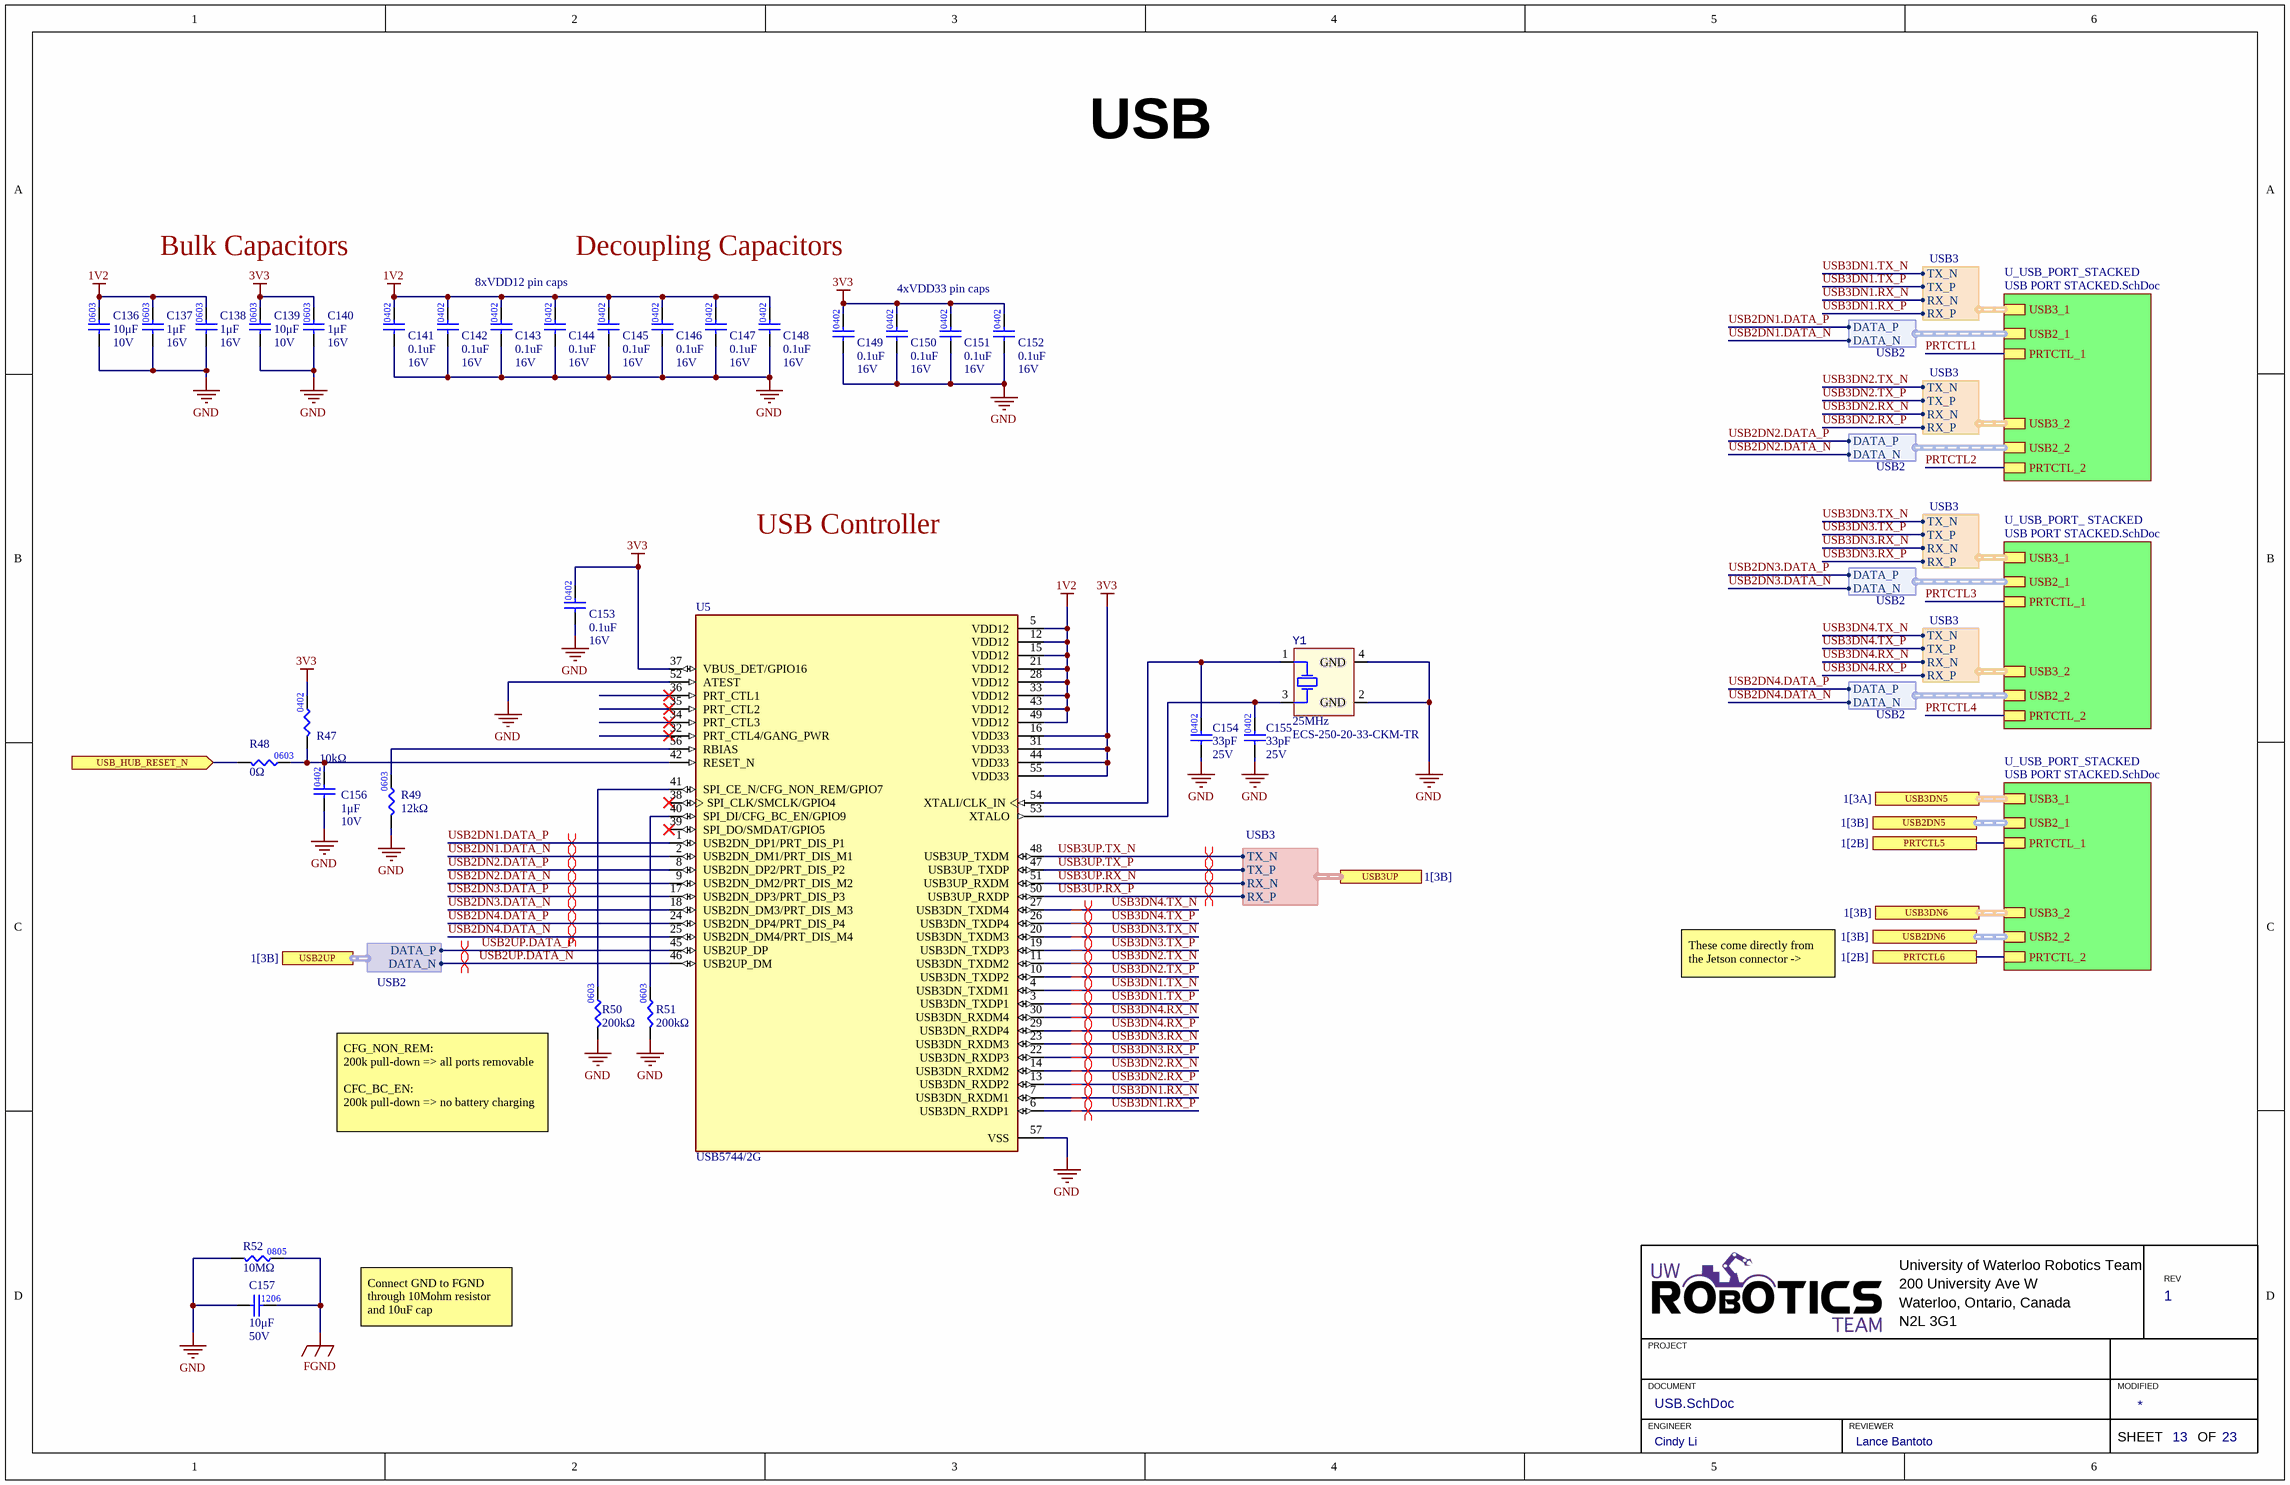
[diagram p3: USB.SchDoc]

### Parts
C136  value 10μF  Voltage Rating: 10V  [CAP0603]  (hidden comment: CAP_10uF_10V_0603)
C137  value 1μF  Voltage Rating: 16V  [CAP0603]  (hidden comment: CAP_1uF_16V_0603)
C138  value 1μF  Voltage Rating: 16V  [CAP0603]  (hidden comment: CAP_1uF_16V_0603)
C139  value 10μF  Voltage Rating: 10V  [CAP0603]  (hidden comment: CAP_10uF_10V_0603)
C140  value 1μF  Voltage Rating: 16V  [CAP0603]  (hidden comment: CAP_1uF_16V_0603)
C141  Rated DC Voltage (URdc): 16V  Capacitance: 0.1uF  [CAP0402]  (hidden comment: CAP_0.1uF_16V_X7R_0402)
C142  Rated DC Voltage (URdc): 16V  Capacitance: 0.1uF  [CAP0402]  (hidden comment: CAP_0.1uF_16V_X7R_0402)
C143  Rated DC Voltage (URdc): 16V  Capacitance: 0.1uF  [CAP0402]  (hidden comment: CAP_0.1uF_16V_X7R_0402)
C144  Rated DC Voltage (URdc): 16V  Capacitance: 0.1uF  [CAP0402]  (hidden comment: CAP_0.1uF_16V_X7R_0402)
C145  Rated DC Voltage (URdc): 16V  Capacitance: 0.1uF  [CAP0402]  (hidden comment: CAP_0.1uF_16V_X7R_0402)
C146  Rated DC Voltage (URdc): 16V  Capacitance: 0.1uF  [CAP0402]  (hidden comment: CAP_0.1uF_16V_X7R_0402)
C147  Rated DC Voltage (URdc): 16V  Capacitance: 0.1uF  [CAP0402]  (hidden comment: CAP_0.1uF_16V_X7R_0402)
C148  Rated DC Voltage (URdc): 16V  Capacitance: 0.1uF  [CAP0402]  (hidden comment: CAP_0.1uF_16V_X7R_0402)
C149  Rated DC Voltage (URdc): 16V  Capacitance: 0.1uF  [CAP0402]  (hidden comment: CAP_0.1uF_16V_X7R_0402)
C150  Rated DC Voltage (URdc): 16V  Capacitance: 0.1uF  [CAP0402]  (hidden comment: CAP_0.1uF_16V_X7R_0402)
C151  Rated DC Voltage (URdc): 16V  Capacitance: 0.1uF  [CAP0402]  (hidden comment: CAP_0.1uF_16V_X7R_0402)
C152  Rated DC Voltage (URdc): 16V  Capacitance: 0.1uF  [CAP0402]  (hidden comment: CAP_0.1uF_16V_X7R_0402)
C153  Rated DC Voltage (URdc): 16V  Capacitance: 0.1uF  [CAP0402]  (hidden comment: CAP_0.1uF_16V_X7R_0402)
C154  value 33pF  Voltage Rating: 25V  [CAP0402]  (hidden comment: CAP_33pF_25V_0402)
C155  value 33pF  Voltage Rating: 25V  [CAP0402]  (hidden comment: CAP_33pF_25V_0402)
C156  Capacitance: 1μF  Rated DC Voltage (URdc): 10V  [CAP0402]  (hidden comment: CAP_1UF_10V_0402_X5R)
C157  value 10μF  Voltage Rating: 50V  [CAP1206]  (hidden comment: CAP_10uF_50V_1206)
R47  Resistance: 10kΩ  [RES0402]  (hidden comment: RES_10kΩ_0402_1%)
R48  value 0Ω  [RES0603]  (hidden comment: RES_0Ω_0603)
R49  value 12kΩ  [RES0603]  (hidden comment: RES_12kΩ_0603)
R50  value 200kΩ  [RES0603]  (hidden comment: RES_200kΩ_0603_5%)
R51  value 200kΩ  [RES0603]  (hidden comment: RES_200kΩ_0603_5%)
R52  value 10MΩ  [RES0805]  (hidden comment: RES_10MΩ_0805)
U5  USB5744/2G  [QFN40P700X700X100-57N]
Y1  Frequency: 25MHz  Manufacturer Part Number 1: ECS-250-20-33-CKM-TR  [XTAL_ECS-250-20-33-CKM-TR]  (hidden comment: CRYSTAL_25MHZ_20PF)

### Sub-sheets
U_USB_PORT_ STACKED = USB PORT STACKED.SchDoc: USB3_1 (harness USB3), PRTCTL_1, USB2_1 (harness USB2), USB3_2 (harness USB3), USB2_2 (harness USB2), PRTCTL_2
U_USB_PORT_STACKED = USB PORT STACKED.SchDoc: USB3_1 (harness USB3), PRTCTL_1, USB2_1 (harness USB2), USB3_2 (harness USB3), USB2_2 (harness USB2), PRTCTL_2
U_USB_PORT_STACKED = USB PORT STACKED.SchDoc: USB3_1 (harness USB3), PRTCTL_1, USB2_1 (harness USB2), USB3_2 (harness USB3), USB2_2 (harness USB2), PRTCTL_2

### Ports
PRTCTL5 (see 1[2B]), PRTCTL6 (see 1[2B]), USB2DN5 (see 1[3B]), USB2DN6 (see 1[3B]), USB2UP (harness USB2, see 1[3B]), USB3DN5 (see 1[3A]), USB3DN6 (see 1[3B]), USB3UP (harness USB3, see 1[3B]), USB_HUB_RESET_N (in)

### Harnesses
USB3: TX_N, TX_P, RX_N, RX_P
USB2: DATA_P, DATA_N
USB3: RX_N, RX_P, TX_P, TX_N

### Nets
1V2: C136.2 C137.2 C138.2 C141.2 C142.2 C143.2 C144.2 C145.2 C146.2 C147.2 C148.2 U5.5(VDD12) U5.12(VDD12) U5.15(VDD12) U5.21(VDD12) U5.28(VDD12) U5.33(VDD12) U5.43(VDD12) U5.49(VDD12)
3V3: C139.2 C140.2 C149.2 C150.2 C151.2 C152.2 C153.2 R47.2 U5.16(VDD33) U5.31(VDD33) U5.37(VBUS_DET/GPIO16) U5.44(VDD33) U5.55(VDD33)
FGND: C157.2 R52.2
GND: C136.1 C137.1 C138.1 C139.1 C140.1 C141.1 C142.1 C143.1 C144.1 C145.1 C146.1 C147.1 C148.1 C149.1 C150.1 C151.1 C152.1 C153.1 C154.1 C155.1 C156.1 C157.1 R49.1 R50.1 R51.1 R52.1 U5.52(ATEST) U5.57(VSS) Y1.2(GND) Y1.4(GND)
PRTCTL1: sheet U_USB_PORT_STACKED/PRTCTL_1
PRTCTL2: sheet U_USB_PORT_STACKED/PRTCTL_2
PRTCTL3: sheet U_USB_PORT_ STACKED/PRTCTL_1
PRTCTL4: sheet U_USB_PORT_ STACKED/PRTCTL_2
USB2DN1.DATA_N: U5.2(USB2DN_DM1/PRT_DIS_M1) ; sheet U_USB_PORT_STACKED/USB2_1.DATA_N
USB2DN1.DATA_P: U5.1(USB2DN_DP1/PRT_DIS_P1) ; sheet U_USB_PORT_STACKED/USB2_1.DATA_P
USB2DN2.DATA_N: U5.9(USB2DN_DM2/PRT_DIS_M2) ; sheet U_USB_PORT_STACKED/USB2_2.DATA_N
USB2DN2.DATA_P: U5.8(USB2DN_DP2/PRT_DIS_P2) ; sheet U_USB_PORT_STACKED/USB2_2.DATA_P
USB2DN3.DATA_N: U5.18(USB2DN_DM3/PRT_DIS_M3) ; sheet U_USB_PORT_ STACKED/USB2_1.DATA_N
USB2DN3.DATA_P: U5.17(USB2DN_DP3/PRT_DIS_P3) ; sheet U_USB_PORT_ STACKED/USB2_1.DATA_P
USB2DN4.DATA_N: U5.25(USB2DN_DM4/PRT_DIS_M4) ; sheet U_USB_PORT_ STACKED/USB2_2.DATA_N
USB2DN4.DATA_P: U5.24(USB2DN_DP4/PRT_DIS_P4) ; sheet U_USB_PORT_ STACKED/USB2_2.DATA_P
USB2UP.DATA_N: U5.46(USB2UP_DM) ; port USB2UP.DATA_N
USB2UP.DATA_P: U5.45(USB2UP_DP) ; port USB2UP.DATA_P
USB3DN1.RX_N: U5.7(USB3DN_RXDM1) ; sheet U_USB_PORT_STACKED/USB3_1.RX_N
USB3DN1.RX_P: U5.6(USB3DN_RXDP1) ; sheet U_USB_PORT_STACKED/USB3_1.RX_P
USB3DN1.TX_N: U5.4(USB3DN_TXDM1) ; sheet U_USB_PORT_STACKED/USB3_1.TX_N
USB3DN1.TX_P: U5.3(USB3DN_TXDP1) ; sheet U_USB_PORT_STACKED/USB3_1.TX_P
USB3DN2.RX_N: U5.14(USB3DN_RXDM2) ; sheet U_USB_PORT_STACKED/USB3_2.RX_N
USB3DN2.RX_P: U5.13(USB3DN_RXDP2) ; sheet U_USB_PORT_STACKED/USB3_2.RX_P
USB3DN2.TX_N: U5.11(USB3DN_TXDM2) ; sheet U_USB_PORT_STACKED/USB3_2.TX_N
USB3DN2.TX_P: U5.10(USB3DN_TXDP2) ; sheet U_USB_PORT_STACKED/USB3_2.TX_P
USB3DN3.RX_N: U5.23(USB3DN_RXDM3) ; sheet U_USB_PORT_ STACKED/USB3_1.RX_N
USB3DN3.RX_P: U5.22(USB3DN_RXDP3) ; sheet U_USB_PORT_ STACKED/USB3_1.RX_P
USB3DN3.TX_N: U5.20(USB3DN_TXDM3) ; sheet U_USB_PORT_ STACKED/USB3_1.TX_N
USB3DN3.TX_P: U5.19(USB3DN_TXDP3) ; sheet U_USB_PORT_ STACKED/USB3_1.TX_P
USB3DN4.RX_N: U5.30(USB3DN_RXDM4) ; sheet U_USB_PORT_ STACKED/USB3_2.RX_N
USB3DN4.RX_P: U5.29(USB3DN_RXDP4) ; sheet U_USB_PORT_ STACKED/USB3_2.RX_P
USB3DN4.TX_N: U5.27(USB3DN_TXDM4) ; sheet U_USB_PORT_ STACKED/USB3_2.TX_N
USB3DN4.TX_P: U5.26(USB3DN_TXDP4) ; sheet U_USB_PORT_ STACKED/USB3_2.TX_P
USB3UP.RX_N: U5.51(USB3UP_RXDM) ; port USB3UP.RX_N
USB3UP.RX_P: U5.50(USB3UP_RXDP) ; port USB3UP.RX_P
USB3UP.TX_N: U5.48(USB3UP_TXDM) ; port USB3UP.TX_N
USB3UP.TX_P: U5.47(USB3UP_TXDP) ; port USB3UP.TX_P
NetC154_2: C154.2 U5.54(XTALI/CLK_IN) Y1.1(HOT)
NetC155_2: C155.2 U5.53(XTALO) Y1.3(HOT)
NetC156_2: C156.2 R47.1 R48.2 U5.42(RESET_N)
NetR48_1: R48.1 ; port USB_HUB_RESET_N
NetR49_2: R49.2 U5.56(RBIAS)
NetR50_2: R50.2 U5.41(SPI_CE_N/CFG_NON_REM/GPIO7)
NetR51_2: R51.2 U5.40(SPI_DI/CFG_BC_EN/GPIO9)
(unnamed): port PRTCTL5, sheet U_USB_PORT_STACKED/PRTCTL_1
(unnamed): port PRTCTL6, sheet U_USB_PORT_STACKED/PRTCTL_2

Not connected (* = marked no-connect by the designer): U5 32(PRT_CTL4/GANG_PWR)* 34(PRT_CTL3)* 35(PRT_CTL2)* 36(PRT_CTL1)* 38(SPI_CLK/SMCLK/GPIO4)* 39(SPI_DO/SMDAT/GPIO5)*

### Buses and harness runs
harness port USB2DN5 = sheet U_USB_PORT_STACKED/USB2_1
harness port USB2DN6 = sheet U_USB_PORT_STACKED/USB2_2
harness port USB3DN5 = sheet U_USB_PORT_STACKED/USB3_1
harness port USB3DN6 = sheet U_USB_PORT_STACKED/USB3_2

### Layout directives
differential pair: USB2DN1.DATA_N, USB2DN1.DATA_P, USB2DN2.DATA_N, USB2DN2.DATA_P, USB2DN3.DATA_N, USB2DN3.DATA_P, USB2DN4.DATA_N, USB2DN4.DATA_P, USB2UP.DATA_N, USB2UP.DATA_P, USB3DN1.RX_N, USB3DN1.RX_P, USB3DN1.TX_N, USB3DN1.TX_P, USB3DN2.RX_N, USB3DN2.RX_P, USB3DN2.TX_N, USB3DN2.TX_P, USB3DN3.RX_N, USB3DN3.RX_P, USB3DN3.TX_N, USB3DN3.TX_P, USB3DN4.RX_N, USB3DN4.RX_P, USB3DN4.TX_N, USB3DN4.TX_P, USB3UP.RX_N, USB3UP.RX_P, USB3UP.TX_N, USB3UP.TX_P

### Notes on the sheet
- Bulk Capacitors
- 8xVDD12 pin caps
- Decoupling Capacitors
- 4xVDD33 pin caps
- USB Controller
- These come directly from the Jetson connector ->
- (near R50) CFG_NON_REM:
  200k pull-down => all ports removable
  CFC_BC_EN:
  200k pull-down => no battery charging
- Connect GND to FGND through 10Mohm resistor and 10uF cap
- University of Waterloo Robotics Team
- 200 University Ave W
- REV
- PROJECT
- Waterloo, Ontario, Canada
- N2L 3G1
- DOCUMENT
- ENGINEER
- REVIEWER
- MODIFIED
- SHEET
- OF
- (in symbol CAP_10uF_10V_0603) 0603
- (in symbol RES_10MΩ_0805_5%) 0805

### Library data of the parts
C136 C139 = CAP_10uF_10V_0603: CAP CER 10UF 10V X5R 0603; Manufacturer 1: Yageo; Manufacturer Part Number 1: CC0603MRX5R6BB106; Supplier Part Number 1: 311-1817-1-ND; Supplier 1: Digi-Key; Dielectric: X5R
C137 C138 C140 = CAP_1uF_16V_0603: CAP CER 1UF 16V Y5V 0603; Manufacturer Part Number 1: CC0603ZRY5V7BB105; Manufacturer 1: Yageo; Package/Footprint: 0603; Supplier Part Number 1: 311-1372-1-ND; Supplier 1: Digi-Key; Dielectric: Y5V; Mounting Type: SMD
C141-C153 = CAP_0.1uF_16V_X7R_0402: as C170 on sheet HDMI; Supplier Part Number 1: 587-6337-1-ND; Supplier 1: Digi-Key; RoHS: Yes; Stock 1: 703; Pricing 1: 1=0.29000, 10=0.20100, 50=0.12060, 100=0.10180, 500=0.06966, 1000=0.06163 (USD); ComponentLink1URL: https://datasheet.ciiva.com:443/pdfs/VipMasterIC/IC/TAIY/TAIY-S-A0009099504/TAIY-S-A0009099407-1.pdf?src-supplier=IHS+Markit; ComponentLink1Description: https://datasheet.ciiva.com:443/pdfs/VipMasterIC/IC/TAIY/TAIY-S-A0009099504/TAIY-S-A0009099407-1.pdf?src-supplier=IHS+Markit; ComponentLink2URL: https://ds.yuden.co.jp/TYCOMPAS/ut/detail?pn=LMK212AC6106MD-T &amp;u=M&src-supplier=Digi-Key; ComponentLink2Description: https://ds.yuden.co.jp/TYCOMPAS/ut/detail?pn=LMK212AC6106MD-T &amp;u=M&src-supplier=Digi-Key; Supplier 2: Digi-Key; Supplier Part Number 2: 1292-1630-1-ND; Category: Ceramic Capacitors; Stock 2: 20327886; Pricing 2: 1=0.10000, 10=0.02800, 50=0.01500, 100=0.01220, 500=0.00876, 1000=0.00688, 2500=0.00625, 5000=0.00575 (USD); Mount: Surface Mount; Number of Pins: 2; Dielectric Material: Ceramic; Package Shape: Rectangular; Terminal Finish: Nickel; Min Operating Temperature: -55°C; Max Operating Temperature: 125°C; JESD-609 Code: e3; Capacitor Type: Ceramic; Package Style: SMTMeter; Packaging: Tape and Reel; Positive Tolerance: 10%; Termination: Wraparound; Length: 1mm; Width: 0.5mm; Height: 0.5mm; REACH SVHC: Yes; RoHS Compliant: Yes; ComponentLink3URL: https://datasheet.ciiva.com:443/pdfs/VipMasterIC/IC/WATC/WATC-S-A0009550342/WATC-S-A0009550342-1.pdf?src-supplier=IHS+Markit; ComponentLink3Description: https://datasheet.ciiva.com:443/pdfs/VipMasterIC/IC/WATC/WATC-S-A0009550342/WATC-S-A0009550342-1.pdf?src-supplier=IHS+Markit; ComponentLink4URL: http://www.farnell.com/datasheets/2340522.pdf?src-supplier=Farnell; ComponentLink4Description: http://www.farnell.com/datasheets/2340522.pdf?src-supplier=Farnell; ComponentLink5URL: http://components.arrow.com/part/dataview/0323_00654690?src-supplier=Arrow+Europe; ComponentLink5Description: http://components.arrow.com/part/dataview/0323_00654690?src-supplier=Arrow+Europe; ComponentLink6URL: https://www.verical.com/server-webapp/html/getDatasheet?partID=415228&src-supplier=Verical; ComponentLink6Description: https://www.verical.com/server-webapp/html/getDatasheet?partID=415228&src-supplier=Verical; ComponentLink7URL: http://www.passivecomponent.com/indexsea/0402B104K160CT-IN.pdf?src-supplier=Digi-Key; ComponentLink7Description: http://www.passivecomponent.com/indexsea/0402B104K160CT-IN.pdf?src-supplier=Digi-Key; ComponentLink8URL: http://www.passivecomponent.com/wp-content/uploads/2018/10/MLCC.pdf?src-supplier=Digi-Key; ComponentLink8Description: http://www.passivecomponent.com/wp-content/uploads/2018/10/MLCC.pdf?src-supplier=Digi-Key; ComponentLink9URL: http://www.farnell.com/datasheets/2340522.pdf?src-supplier=Element14; ComponentLink9Description: http://www.farnell.com/datasheets/2340522.pdf?src-supplier=Element14; ComponentLink10URL: http://www.farnell.com/datasheets/2340522.pdf?src-supplier=Newark; ComponentLink10Description: http://www.farnell.com/datasheets/2340522.pdf?src-supplier=Newark; Size Code: 0402; Supplier 3: Digi-Key; Supplier Part Number 3: 445-173645-1-ND; Stock 3: 3627; Pricing 3: 1=0.20000, 10=0.14200, 50=0.08080, 100=0.06700, 500=0.04696, 1000=0.03888, 2500=0.03619, 5000=0.03311 (USD); ComponentLink11URL: https://datasheet.ciiva.com:443/pdfs/VipMasterIC/IC/TDKC/TDKC-S-A0007785269/TDKC-S-A0007785269-1.pdf?src-supplier=IHS+Markit; ComponentLink11Description: https://datasheet.ciiva.com:443/pdfs/VipMasterIC/IC/TDKC/TDKC-S-A0007785269/TDKC-S-A0007785269-1.pdf?src-supplier=IHS+Markit; ComponentLink12URL: https://product.tdk.com/info/en/catalog/spec/mlccspec_commercial_soft_en.pdf?src-supplier=Digi-Key; ComponentLink12Description: https://product.tdk.com/info/en/catalog/spec/mlccspec_commercial_soft_en.pdf?src-supplier=Digi-Key
C154 C155 = CAP_33pF_25V_0402: CAP CER 33PF 25V C0G/NP0 0402; Manufacturer 1: AVX Corporation; Manufacturer Part Number 1: 04023A330JAT2A; Package/Footprint: 0402; Dielectric: C0G; Supplier 1: Digi-Key; Mounting Type: SMD; Supplier Part Number 1: 478-12613-1-ND
C156 = CAP_1UF_10V_0402_X5R: CAP CER 1UF 10V X5R 0402; Manufacturer: Kyocera AVX; Manufacturer Part Number: 0402ZD105MAT2A; Supplier Part Number 1: 478-5768-1-ND; Supplier 1: Digi-Key; Temperature Characteristics Code: X5R; ComponentLink7URL: https://datasheet.ciiva.com/11531/cx5r-11531784.pdf?src-supplier=Avnet; ComponentLink7Description: https://datasheet.ciiva.com/11531/cx5r-11531784.pdf?src-supplier=Avnet; Mounting Type: Surface Mount; Package: 0402
C157 = CAP_10uF_50V_1206: CAP CER 10UF 50V X5R 1206; Manufacturer 1: Murata; Manufacturer Part Number 1: GRT31CR61H106KE01L; Package/Footprint: 1206; Supplier Part Number 1: 490-12456-1-ND; Supplier 1: Digi-Key; Mounting Type: SMD; Dielectric: X5R
R47 = RES_10kΩ_0402_1%: RES 10K OHM 1% 1/16W 0402; Manufacturer Part Number 1: RC1005F103CS; Manufacturer 1: Samsung Electro-Mechanics; Supplier 1: Digi-Key; Supplier Part Number 1: 1276-3431-1-ND; Tolerance: 1%; Package: 0402
R48 = RES_0Ω_0603: as R59 on sheet HDMI; Supplier Part Number 1: 311-0.0GRCT-ND; Supplier 1: Digi-Key; Mounting Type: SMD
R49 = RES_12kΩ_0603_1%: RES 12K OHM 1% 1/10W 0603; Manufacturer 1: Vishay Dale; Manufacturer Part Number 1: CRCW060312K0FKEAC; Power: 0.1W; Supplier Part Number 1: 541-4046-1-ND; Supplier 1: Digi-Key; Tolerance: 1%; Package: 0603
R50 R51 = RES_200kΩ_0603_5%: RES SMD 200K OHM 5% 1/10W 0603; Manufacturer 1: Panasonic Electronic Components; Manufacturer Part Number 1: ERJ-3GEYJ204V; Package/Footprint: 0603; Supplier Part Number 1: P200KGCT-ND; Supplier 1: Digi-Key; Mounting Type: SMD
R52 = RES_10MΩ_0805_5%: RES 10M OHM 5% 1/8W 0805; Manufacturer 1: Yageo; Manufacturer Part Number 1: RC0805JR-0710ML; Supplier Part Number 1: 311-10MARCT-ND; Supplier 1: Digi-Key
U5 = USB5744/2G: USB Hub Controller USB 3.1 USB Interface 56-VQFN (7x7); Manufacturer 1: Microchip Technology; Standards: USB 3.1; Supply Voltage: 1.2V, 3.3V; Manufacturer Part Number 1: USB5744/2G; Supplier 1: Digi-Key; Supplier Part Number 1: USB5744/2G-ND; Package: 56-VQFN (7x7)
Y1 = CRYSTAL_25MHZ_20PF: CRYSTAL 25.0000MHZ 20PF SMD; Manufacturer 1: ECS Inc.; Mounting Type: SMD; Package/Footprint: SMD; Load Capacitance: 20pF; Supplier 1: Digi-Key; Supplier Part Number 1: XC1817CT-ND